# Altium schematic sheet cellular.SchDoc
size D; CompanyName: Signal Laboratories, Inc.; Address1: 3479 Edison Way; Address2: Menlo Park CA 94025; Address3: +1 (877) 778-8435; Address4: siglabs.com; Revision: 1; SheetNumber: 1; SheetTotal: 1
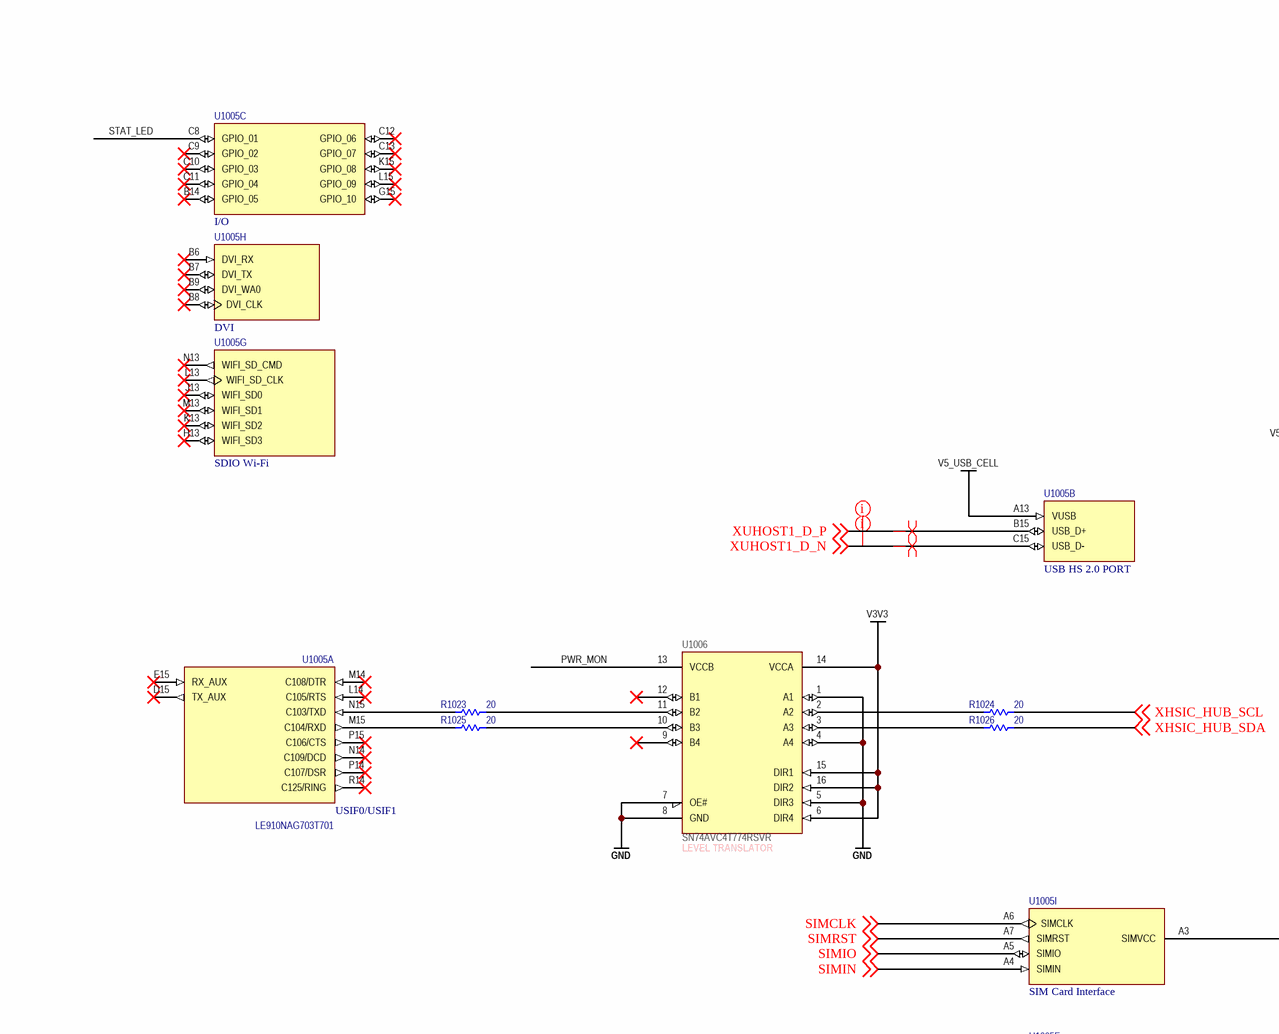
[diagram p0: cellular.SchDoc, top left]
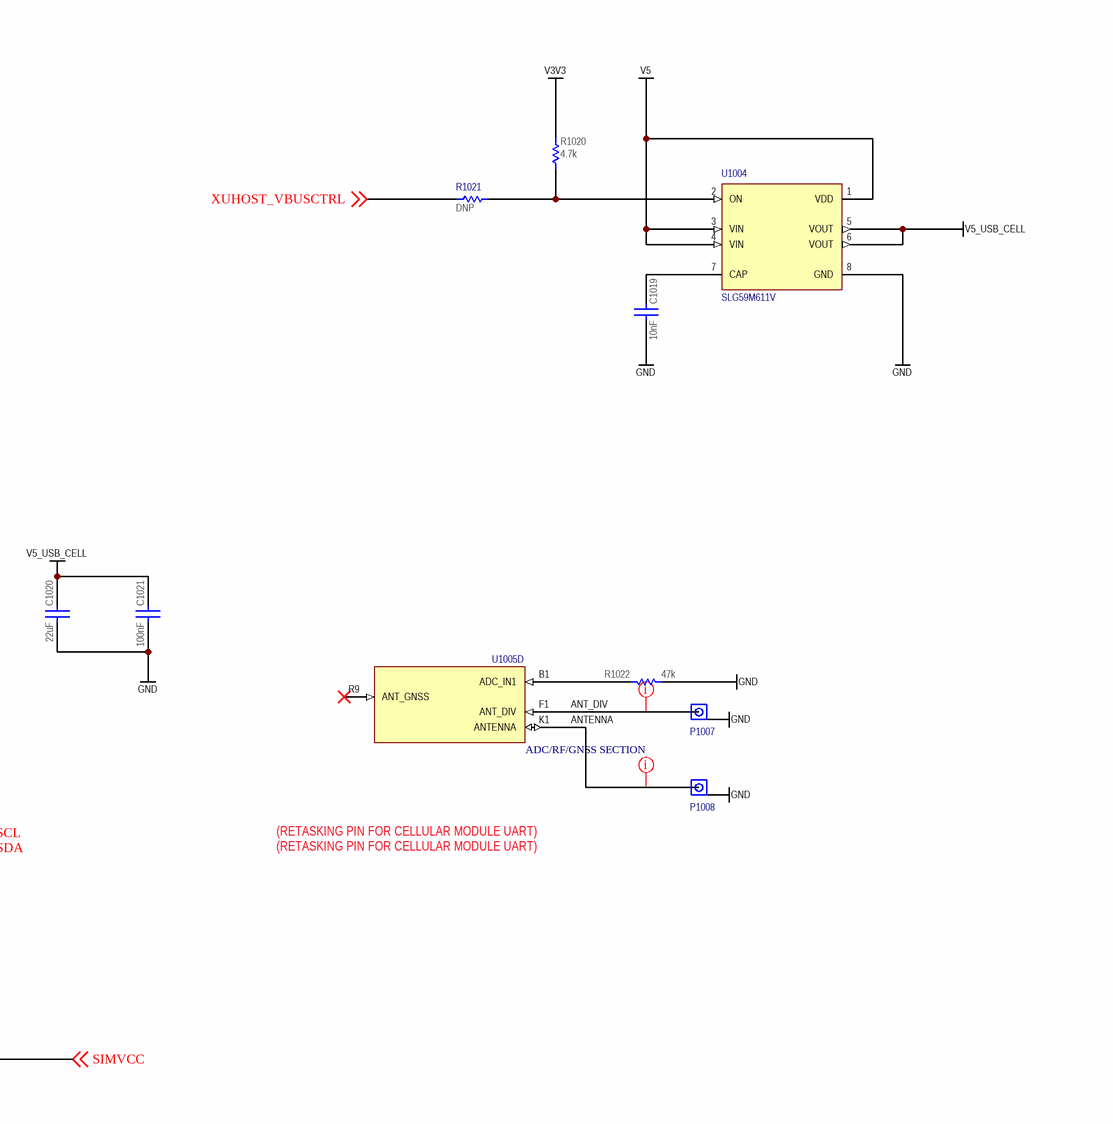
[diagram p1: cellular.SchDoc, top right]
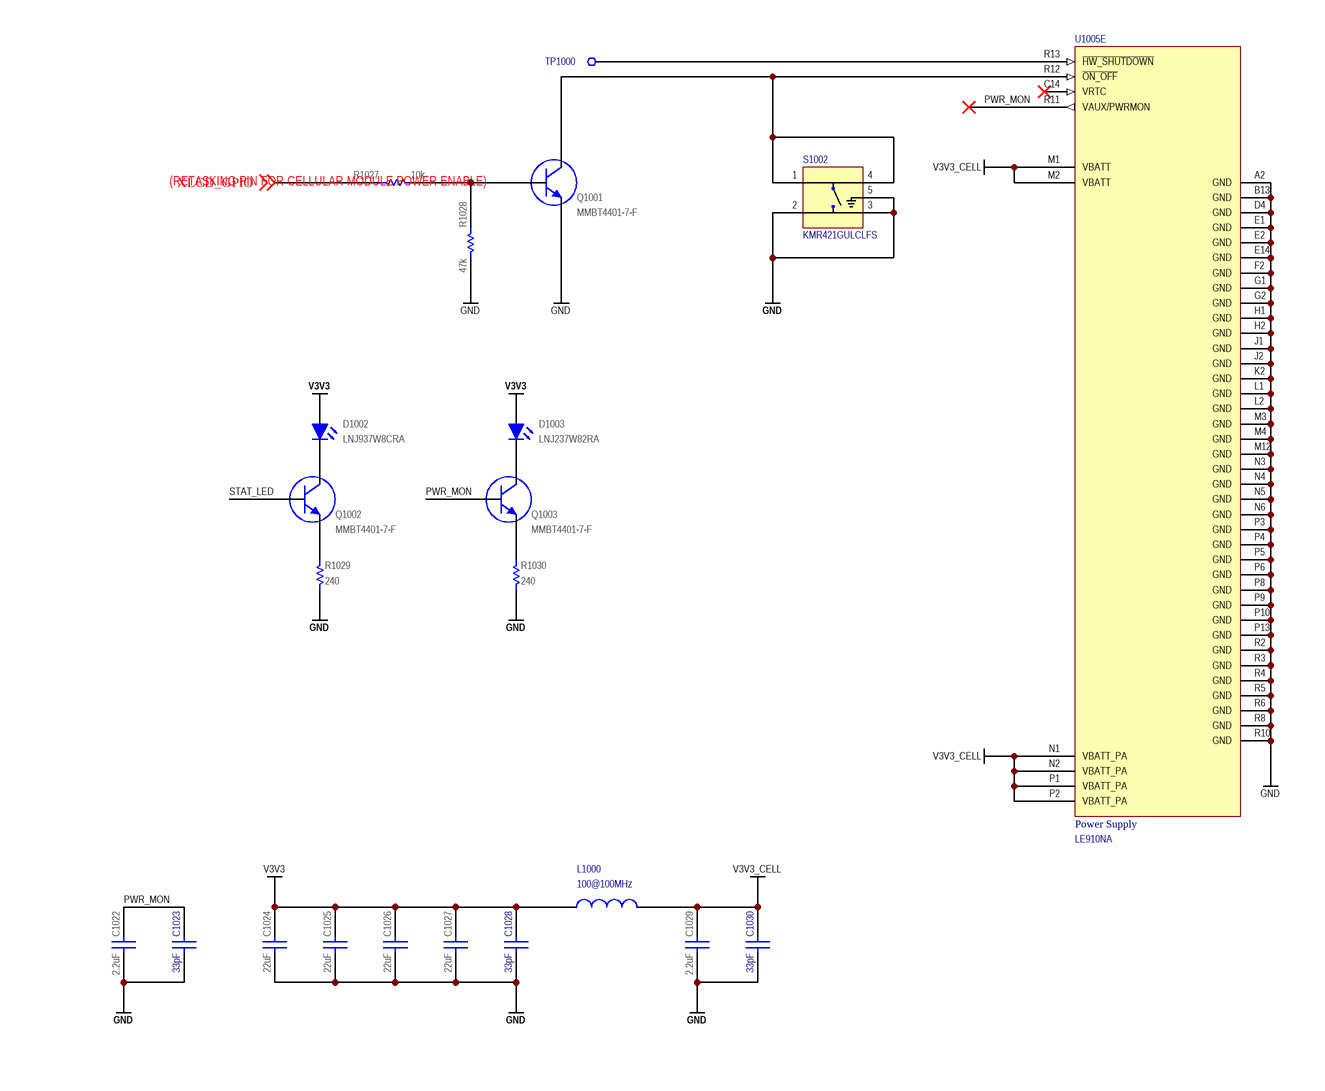
[diagram p2: cellular.SchDoc, bottom left]
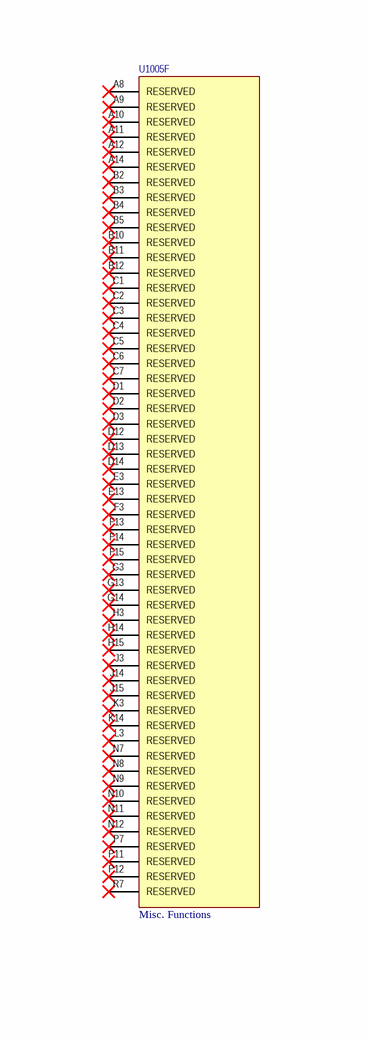
[diagram p3: cellular.SchDoc, bottom right]

## Parts
C1019  value 10nF  [CAPC100X50X55L25N]  (hidden comment: GCM155R71H103KA55)
C1020  value 22uF  [CAPC200X125X145L45N]  (hidden comment: C2012X7S1A226M125)
C1021  value 100nF  [CAPC100X50X55L25N]  (hidden comment: GCM155R71H104KE02)
C1022  value 2.2uF  [CAPC160X80X90L20N]  (hidden comment: C1608X7R1A225M080)
C1023  value 33pF  [0402]  (hidden comment: CBR04C330F5GAC)
C1024  value 22uF  [CAPC200X125X145L45N]  (hidden comment: C2012X7S1A226M125)
C1025  value 22uF  [CAPC200X125X145L45N]  (hidden comment: C2012X7S1A226M125)
C1026  value 22uF  [CAPC200X125X145L45N]  (hidden comment: C2012X7S1A226M125)
C1027  value 22uF  [CAPC200X125X145L45N]  (hidden comment: C2012X7S1A226M125)
C1028  value 33pF  [0402]  (hidden comment: CBR04C330F5GAC)
C1029  value 2.2uF  [CAPC160X80X90L20N]  (hidden comment: C1608X7R1A225M080)
C1030  value 33pF  [0402]  (hidden comment: CBR04C330F5GAC)
D1002  LNJ937W8CRA  [0603_LED]
D1003  LNJ237W82RA  [0603_LED]
L1000  value 100@100MHz  [0603]  (hidden comment: BLM15PX601SN1D)
P1007  U.FL-R-SMT(10)  [U.FL-R-SMT(10)]  (value not drawn)
P1008  U.FL-R-SMT(10)  [U.FL-R-SMT(10)]  (value not drawn)
Q1001  MMBT4401-7-F  [SOT23]
Q1002  MMBT4401-7-F  [SOT23]
Q1003  MMBT4401-7-F  [SOT23]
R1020  value 4.7k  [RESC1005X40N]  (hidden comment: ERJ-2RKF4701X)
R1021  Do Not Place: DNP  [0402]  (hidden comment: ERJ-2RKF20R0X)
R1022  value 47k  [RESC1005X40N]  (hidden comment: ERJ-2RKF4702X)
R1023  value 20  [0402]  (hidden comment: ERJ-2RKF20R0X)
R1024  value 20  [0402]  (hidden comment: ERJ-2RKF20R0X)
R1025  value 20  [0402]  (hidden comment: ERJ-2RKF20R0X)
R1026  value 20  [0402]  (hidden comment: ERJ-2RKF20R0X)
R1027  value 10k  [RESC1005X40N]  (hidden comment: ERJ-2RKF1002X)
R1028  value 47k  [RESC1005X40N]  (hidden comment: ERJ-2RKF4702X)
R1029  value 240  [RESC1005X40N]  (hidden comment: ERJ-2RKF2400X)
R1030  value 240  [RESC1005X40N]  (hidden comment: ERJ-2RKF2400X)
S1002  KMR421GULCLFS  [SW_KMR421GULCLFS]
TP1000  TEST_POINT_SMD_10  [TEST_POINT_SMD_10]  (value not drawn)  (no BOM)
U1004  SLG59M611V  [DFN200X150X80-8N]
U1005  LE910NAG703T701  [LGA144S180P15X15_2820X2820X225_LE910NAG703T701(Primary)]  (parts A,B,C,D,E,F,G,H,I of 9)
U1006  SN74AVC4T774RSVR  [RSV]

## Nets
GND: C1019.1 C1020.1 C1021.1 C1022.1 C1023.2 C1024.1 C1025.1 C1026.1 C1027.1 C1028.2 C1029.1 C1030.2 P1007.2(GND) P1008.2(GND) Q1001.2(E) R1022.1 R1028.1 R1029.2 R1030.2 S1002.2 S1002.3 S1002.5(G) U1004.8(GND) U1005.A2(GND) U1005.B13(GND) U1005.D4(GND) U1005.E1(GND) U1005.E2(GND) U1005.E14(GND) U1005.F2(GND) U1005.G1(GND) U1005.G2(GND) U1005.H1(GND) U1005.H2(GND) U1005.J1(GND) U1005.J2(GND) U1005.K2(GND) U1005.L1(GND) U1005.L2(GND) U1005.M3(GND) U1005.M4(GND) U1005.M12(GND) U1005.N3(GND) U1005.N4(GND) U1005.N5(GND) U1005.N6(GND) U1005.P3(GND) U1005.P4(GND) U1005.P5(GND) U1005.P6(GND) U1005.P8(GND) U1005.P9(GND) U1005.P10(GND) U1005.P13(GND) U1005.R2(GND) U1005.R3(GND) U1005.R4(GND) U1005.R5(GND) U1005.R6(GND) U1005.R8(GND) U1005.R10(GND) U1006.1(A1) U1006.4(A4) U1006.5(DIR3) U1006.7(OE#) U1006.8(GND)
V3V3: C1024.2 C1025.2 C1026.2 C1027.2 C1028.1 D1002.1(A) D1003.1(A) L1000.1 R1020.2 U1006.6(DIR4) U1006.14(VCCA) U1006.15(DIR1) U1006.16(DIR2)
V3V3_CELL: C1029.2 C1030.1 L1000.2 U1005.M1(VBATT) U1005.M2(VBATT) U1005.N1(VBATT_PA) U1005.N2(VBATT_PA) U1005.P1(VBATT_PA) U1005.P2(VBATT_PA)
V5: U1004.1(VDD) U1004.3(VIN) U1004.4(VIN)
V5_USB_CELL: C1020.2 C1021.2 U1004.5(VOUT) U1004.6(VOUT) U1005.A13(VUSB)
ANT_DIV: P1007.1(RF) U1005.F1(ANT_DIV)
ANTENNA: P1008.1(RF) U1005.K1(ANTENNA)
PWR_MON: C1022.2 C1023.1 Q1003.1(B) U1005.R11(VAUX/PWRMON) U1006.13(VCCB)
SIMCLK: U1005.A6(SIMCLK) ; off-sheet SIMCLK
SIMIN: U1005.A4(SIMIN) ; off-sheet SIMIN
SIMIO: U1005.A5(SIMIO) ; off-sheet SIMIO
SIMRST: U1005.A7(SIMRST) ; off-sheet SIMRST
SIMVCC: U1005.A3(SIMVCC) ; off-sheet SIMVCC
STAT_LED: Q1002.1(B) U1005.C8(GPIO_01)
XHSIC_HUB_SCL: R1024.1 ; off-sheet XHSIC_HUB_SCL
XHSIC_HUB_SDA: R1026.1 ; off-sheet XHSIC_HUB_SDA
XLCD_GPIO: R1027.2 ; off-sheet XLCD_GPIO
XUHOST1_D_N: U1005.C15(USB_D-) ; off-sheet XUHOST1_D_N
XUHOST1_D_P: U1005.B15(USB_D+) ; off-sheet XUHOST1_D_P
XUHOST_VBUSCTRL: R1021.2 ; off-sheet XUHOST_VBUSCTRL
NetC1019_2: C1019.2 U1004.7(CAP)
NetD1002_2: D1002.2(K) Q1002.3(C)
NetD1003_2: D1003.2(K) Q1003.3(C)
NetQ1001_1: Q1001.1(B) R1027.1 R1028.2
NetQ1001_3: Q1001.3(C) S1002.1 S1002.4 U1005.R12(~{ON_OFF})
NetQ1002_2: Q1002.2(E) R1029.1
NetQ1003_2: Q1003.2(E) R1030.1
NetR1020_1: R1020.1 R1021.1 U1004.2(ON)
NetR1022_2: R1022.2 U1005.B1(ADC_IN1)
NetR1023_1: R1023.1 U1006.11(B2)
NetR1023_2: R1023.2 U1005.N15(C103/TXD)
NetR1024_2: R1024.2 U1006.2(A2)
NetR1025_1: R1025.1 U1006.10(B3)
NetR1025_2: R1025.2 U1005.M15(C104/RXD)
NetR1026_2: R1026.2 U1006.3(A3)
NetTP1000_1: TP1000.1 U1005.R13(~{HW_SHUTDOWN})

Not connected (* = marked no-connect by the designer): U1005 A8(RESERVED)* A9(RESERVED)* A10(RESERVED)* A11(RESERVED)* A12(RESERVED)* A14(RESERVED)* B2(RESERVED)* B3(RESERVED)* B4(RESERVED)* B5(RESERVED)* B6(DVI_RX)* B7(DVI_TX)* B8(DVI_CLK)* B9(DVI_WA0)* B10(RESERVED)* B11(RESERVED)* B12(RESERVED)* B14(GPIO_05)* C1(RESERVED)* C2(RESERVED)* C3(RESERVED)* C4(RESERVED)* C5(RESERVED)* C6(RESERVED)* C7(RESERVED)* C9(GPIO_02)* C10(GPIO_03)* C11(GPIO_04)* C12(GPIO_06)* C13(GPIO_07)* C14(VRTC)* D1(RESERVED)* D2(RESERVED)* D3(RESERVED)* D12(RESERVED)* D13(RESERVED)* D14(RESERVED)* D15(TX_AUX)* E3(RESERVED)* E13(RESERVED)* E15(RX_AUX)* F3(RESERVED)* F13(RESERVED)* F14(RESERVED)* F15(RESERVED)* G3(RESERVED)* G13(RESERVED)* G14(RESERVED)* G15(GPIO_10)* H3(RESERVED)* H13(WIFI_SD3)* H14(RESERVED)* H15(RESERVED)* J3(RESERVED)* J13(WIFI_SD0)* J14(RESERVED)* J15(RESERVED)* K3(RESERVED)* K13(WIFI_SD2)* K14(RESERVED)* K15(GPIO_08)* L3(RESERVED)* L13(WIFI_SD_CLK)* L14(C105/RTS)* L15(GPIO_09)* M13(WIFI_SD1)* M14(C108/DTR)* N7(RESERVED)* N8(RESERVED)* N9(RESERVED)* N10(RESERVED)* N11(RESERVED)* N12(RESERVED)* N13(WIFI_SD_CMD)* N14(C109/DCD)* P7(RESERVED)* P11(RESERVED)* P12(RESERVED)* P14(C107/DSR)* P15(C106/CTS)* R7(RESERVED)* R9(ANT_GNSS)* R14(C125/RING)*; U1006 9(B4)* 12(B1)*

## Layout directives
net class RF: ANT_DIV, ANTENNA
net class USB: XUHOST1_D_N, XUHOST1_D_P
differential pair: XUHOST1_D_N, XUHOST1_D_P

## Notes on the sheet
- (RETASKING PIN FOR CELLULAR MODULE UART)
- (near U1006) LEVEL TRANSLATOR
- (RETASKING PIN FOR CELLULAR MODULE POWER ENABLE)
- Title
- Engineer
- Revision
- Drawn By
- Sheet
- of
- Checked By
- Date
- (in symbol LE910NAG703T701, part A) USIF0/USIF1
- (in symbol LE910NAG703T701, part B) USB HS 2.0 PORT
- (in symbol LE910NAG703T701, part C) I/O
- (in symbol LE910NAG703T701, part D) ADC/RF/GNSS SECTION
- (in symbol LE910NAG703T701, part E) Power Supply
- (in symbol LE910NAG703T701, part F) Misc. Functions
- (in symbol LE910NAG703T701, part G) SDIO Wi-Fi
- (in symbol LE910NAG703T701, part H) DVI
- (in symbol LE910NAG703T701, part I) SIM Card Interface

## Library data of the parts
C1019 = CAP: Ceramic Capacitor 10nF ±10% 50V X7R 0402; Manufacturer: Murata; Tr: -55:125; Manufacturer P/N: GCM155R71H103KA55; Tolerance: ±10%; Voltage: 50V; Footprint: *; Package: 0402
C1020 C1024-C1027 = CAP: Ceramic Capacitor 22uF ±20% 10V X7S 0805; Manufacturer: TDK; Tr: -55:125; Manufacturer P/N: C2012X7S1A226M125; Tolerance: ±20%; Voltage: 10V; Package: 0805
C1021 = CAP: Ceramic Capacitor 100nF ±10% 50V X7R 0402; Manufacturer: Murata; Tr: -55:125; Manufacturer P/N: GCM155R71H104KE02; Tolerance: ±10%; Voltage: 50V; Footprint: *; Package: 0402
C1022 C1029 = CAP: Ceramic Capacitor 2.2uF ±20% 10V X7R 0603; Manufacturer: TDK; Tr: -55:125; Manufacturer P/N: C1608X7R1A225M080; Tolerance: ±20%; Voltage: 10V; Footprint: *; Package: 0603
C1023 C1028 C1030 = CAP 0603: Ceramic Capacitor 33pF ±1% 50V NP0 0402; Manufacturer: Kemet; Tr: -55:125; Voltage: 50V; Manufacturer P/N: CBR04C330F5GAC; Package: 0402; Do Not Place: *; Tolerance: ±1%
D1002 = LED0603GR: LED, SMT 0603, Color Blue, 5mA, 2.9V; Manufacturer: Panasonic; Manufacturer P/N: LNJ937W8CRA; Package: 0603 Polarized
D1003 = LED0603RD: LED, SMT 0603, Color Red, 5mA, 1.85V; Manufacturer: Panasonic; Manufacturer P/N: LNJ237W82RA; Package: 0603 Polarized
L1000 = IND 0402: Ferrite Bead 100-Ohm @ 100MHz 2A 0603; Manufacturer: Murata; Manufacturer P/N: BLM18EG101TN1; Tolerance: ±25%; Tr: -55:125; Package: 0603
P1007 P1008 = U.FL-R-SMT(10): Ultra Miniature Coaxial Jack, 50 Ohms; Manufacturer: Hirose; Manufacturer P/N: U.FL-R-SMT(10)
Q1001-Q1003 = MMBT4401-7-F: NPN Small Signal Transistor SMD SOT-23; Manufacturer: Diodes, Inc.; Manufacturer P/N: MMBT4401-7-F
R1020 = RES: Thick Film Resistor 4.7k ±1% 0.1W 75V 0402; Manufacturer: Panasonic; Tcr: ±100; Tr: -55:155; Voltage: 75; Power: 0.1; Tolerance: ±1%; Manufacturer P/N: ERJ-2RKF4701X; Alternatives: *; Footprint: *; Package: 0402
R1021 = RES 0402: Thick Film Resistor 20 ±1% 0402; Manufacturer: Panasonic; Manufacturer P/N: RC0402FR-0720L; Value: 20; Tr: -55:155; Package: 0402; Tolerance: ±1%
R1022 R1028 = RES: Thick Film Resistor 47k ±1% 0.1W 75V 0402; Manufacturer: Panasonic; Tcr: ±100; Tr: -55:155; Voltage: 75; Power: 0.1; Tolerance: ±1%; Manufacturer P/N: ERJ-2RKF4702X; Alternatives: *; Footprint: *; Package: 0402
R1023-R1026 = RES 0402: Thick Film Resistor 20 ±1% 0402; Manufacturer: Panasonic; Manufacturer P/N: RC0402FR-0720L; Tr: -55:155; Package: 0402; Tolerance: ±1%
R1027 = RES: Thick Film Resistor 10k ±1% 0.1W 0402; Manufacturer: Panasonic; Tcr: ±100; Tr: -55:155; Voltage: 75; Power: 0.1; Tolerance: ±1%; Manufacturer P/N: ERJ-2RKF1002X; Alternatives: *; Footprint: *; Package: 0402
R1029 R1030 = RES: Thick Film Resistor 240 ±1% 0.1W 75V 0402; Manufacturer: Panasonic; Tcr: ±100; Tr: -55:155; Voltage: 75; Power: 0.1; Tolerance: ±1%; Manufacturer P/N: ERJ-2RKF2400X; Alternatives: *; Footprint: *; Package: 0402
S1002 = KMR421GULCLFS: Switch Tactile N.O. SPST Round Button Gull Wing 0.05A 32VDC 1VA 200000Cycles 2N SMD Automotive T/R; Manufacturer: C&K Components; Availability: Good; Package: None; Manufacturer P/N: KMR421GULCLFS; Price: 0.29 USD; Value: *
TP1000 = TEST_POINT_SMD_10: Test Point SMD
U1004 = SLG59M611V: High-Side Load Switch; Manufacturer: Silego; Package: WFDFN-8 Silego; Manufacturer P/N: SLG59M611V
U1005 = LE910NAG703T701: Manufacturer: Telit; Manufacturer P/N: LE910NAG703T701
U1006 = SN74AVC4T774RSVR: 4-Bit Dual-Supply Bus Transceiver; Manufacturer: Texas Instruments; Manufacturer P/N: SN74AVC4T774RSVR